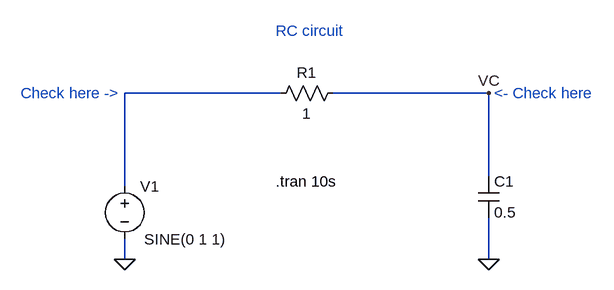
[diagram p0: schematic HLab03_RC.asc]
HLab03_RC.asc, the LTspice schematic file:
Version 4
SHEET 1 880 680
WIRE 336 208 96 208
WIRE 656 208 416 208
WIRE 656 336 656 208
WIRE 96 352 96 208
WIRE 96 464 96 432
WIRE 656 464 656 400
FLAG 96 464 0
FLAG 656 464 0
FLAG 656 208 VC
SYMBOL res 432 192 R90
WINDOW 0 0 56 VBottom 2
WINDOW 3 32 56 VTop 2
SYMATTR InstName R1
SYMATTR Value 1
SYMBOL cap 640 336 R0
SYMATTR InstName C1
SYMATTR Value 0.5
SYMBOL voltage 96 336 R0
WINDOW 3 30 97 Left 2
SYMATTR Value SINE(0 1 1)
SYMATTR InstName V1
TEXT 328 344 Left 2 !.tran 10s
TEXT 664 208 Left 2 ;<- Check here
TEXT -64 208 Left 2 ;Check here ->
TEXT 328 112 Left 2 ;RC circuit

The netlist it stands for:
* HLab03_RC.asc
R1 VC N001 1
C1 VC 0 0.5
V1 N001 0 SINE(0 1 1)
.tran 10s
* <- Check here
* Check here ->
* RC circuit
.backanno
.end